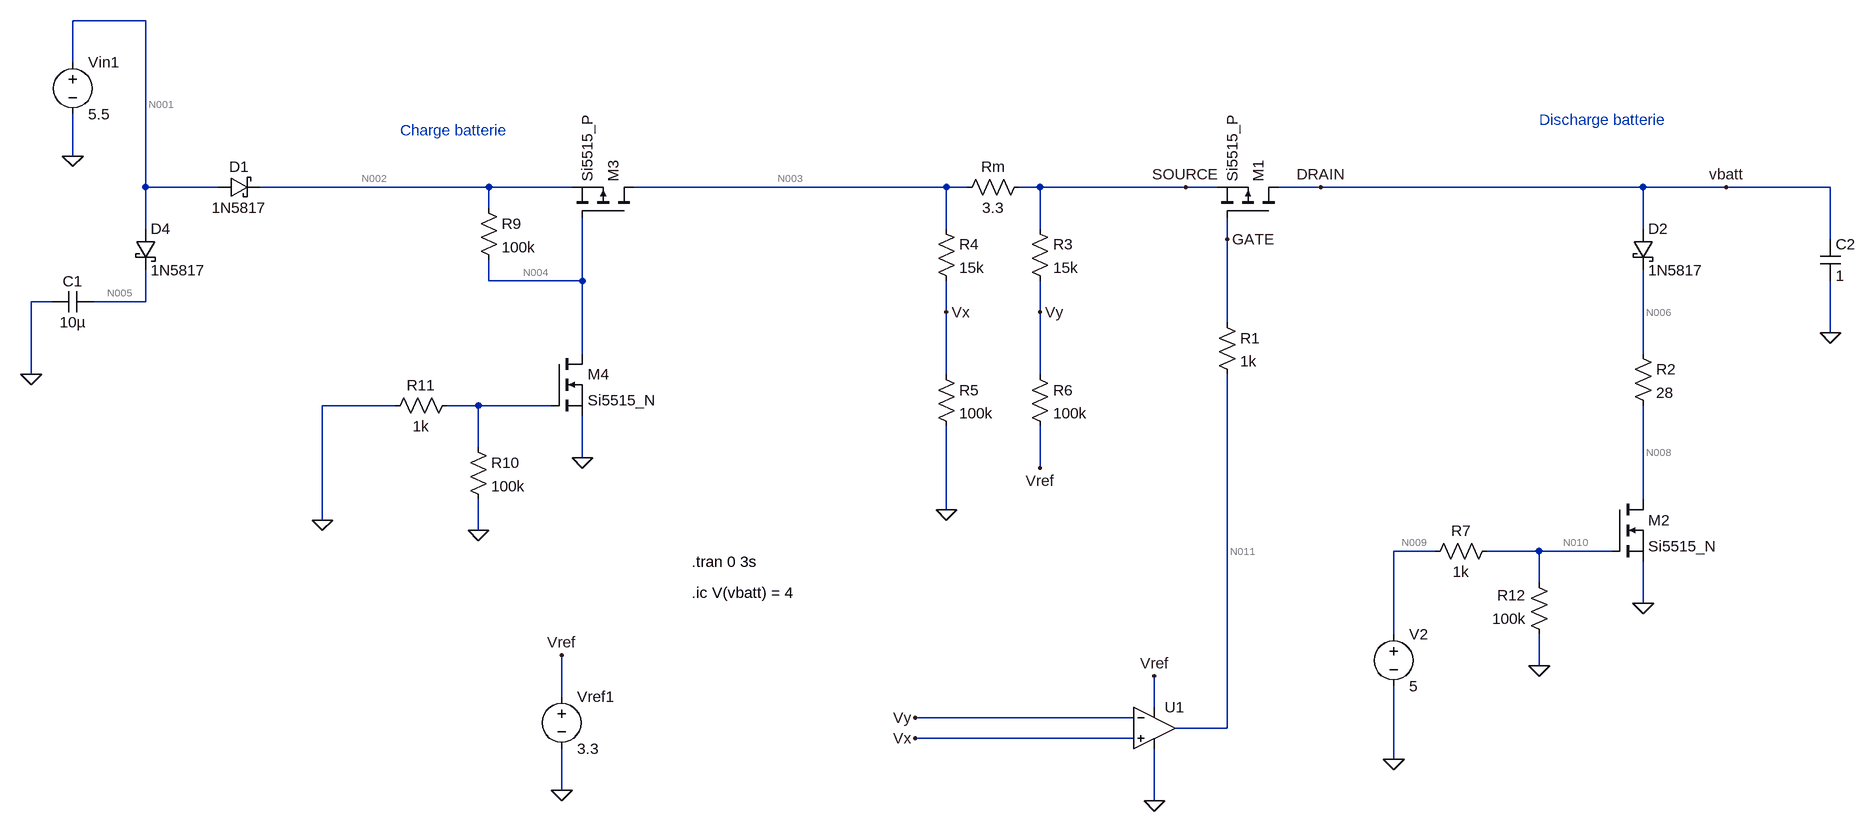
[diagram p0: schematic current_source.asc]
current_source.asc, the LTspice schematic file:
Version 4.1
SHEET 1 2588 1328
WIRE -736 -176 -848 -176
WIRE -848 -112 -848 -176
WIRE -848 32 -848 -32
WIRE -736 80 -736 -176
WIRE -624 80 -736 80
WIRE -208 80 -560 80
WIRE -80 80 -208 80
WIRE 496 80 16 80
WIRE 528 80 496 80
WIRE 640 80 608 80
WIRE 864 80 640 80
WIRE 912 80 864 80
WIRE 1072 80 1008 80
WIRE 1568 80 1072 80
WIRE 1696 80 1568 80
WIRE 1856 80 1696 80
WIRE -208 112 -208 80
WIRE -736 144 -736 80
WIRE 496 144 496 80
WIRE 640 144 640 80
WIRE 1568 144 1568 80
WIRE 928 160 928 128
WIRE 1856 160 1856 80
WIRE -208 224 -208 192
WIRE -64 224 -64 128
WIRE -64 224 -208 224
WIRE -880 256 -912 256
WIRE -736 256 -736 208
WIRE -736 256 -816 256
WIRE 496 272 496 224
WIRE 640 272 640 224
WIRE 928 288 928 160
WIRE 1856 304 1856 224
WIRE -64 336 -64 224
WIRE 1568 336 1568 208
WIRE -912 368 -912 256
WIRE 496 368 496 272
WIRE 640 368 640 272
WIRE -352 416 -464 416
WIRE -224 416 -272 416
WIRE -112 416 -224 416
WIRE -224 480 -224 416
WIRE -64 496 -64 432
WIRE 640 512 640 448
WIRE 1568 560 1568 416
WIRE 496 576 496 448
WIRE -464 592 -464 416
WIRE -224 608 -224 560
WIRE 1248 640 1184 640
WIRE 1408 640 1328 640
WIRE 1520 640 1408 640
WIRE 1408 688 1408 640
WIRE 1568 720 1568 656
WIRE 1184 768 1184 640
WIRE 1408 816 1408 768
WIRE -96 864 -96 800
WIRE 816 880 816 832
WIRE 784 896 448 896
WIRE 928 912 928 368
WIRE 928 912 848 912
WIRE 784 928 448 928
WIRE 1184 960 1184 848
WIRE -96 1008 -96 944
WIRE 816 1024 816 944
FLAG 1856 304 0
FLAG 1568 720 0
FLAG 1184 960 0
FLAG 496 272 Vx
FLAG 640 272 Vy
FLAG 448 928 Vx
FLAG 448 896 Vy
FLAG 496 576 0
FLAG 928 160 GATE
FLAG 864 80 SOURCE
FLAG 1072 80 DRAIN
FLAG 816 832 Vref
FLAG 816 1024 0
FLAG -848 32 0
FLAG -912 368 0
FLAG -64 496 0
FLAG -224 608 0
FLAG 1408 816 0
FLAG -464 592 0
FLAG 1696 80 vbatt
FLAG -96 1008 0
FLAG -96 800 Vref
FLAG 640 512 Vref
SYMBOL res 512 96 R270
WINDOW 0 32 56 VTop 2
WINDOW 3 0 56 VBottom 2
SYMATTR InstName Rm
SYMATTR Value 3.3
SYMBOL pmos 1008 128 M270
SYMATTR InstName M1
SYMATTR Value Si5515_P
SYMBOL nmos 1520 560 R0
SYMATTR InstName M2
SYMATTR Value Si5515_N
SYMBOL res 912 272 R0
SYMATTR InstName R1
SYMATTR Value 1k
SYMBOL res 1552 320 R0
SYMATTR InstName R2
SYMATTR Value 28
SYMBOL schottky -624 96 R270
WINDOW 0 32 32 VTop 2
WINDOW 3 0 32 VBottom 2
SYMATTR InstName D1
SYMATTR Value 1N5817
SYMBOL OpAmps\\UniversalOpAmp2 816 912 R0
SYMATTR InstName U1
SYMBOL res 624 128 R0
SYMATTR InstName R3
SYMATTR Value 15k
SYMBOL res 480 128 R0
SYMATTR InstName R4
SYMATTR Value 15k
SYMBOL res 480 352 R0
SYMATTR InstName R5
SYMATTR Value 100k
SYMBOL res 624 352 R0
SYMATTR InstName R6
SYMATTR Value 100k
SYMBOL schottky 1552 144 R0
SYMATTR InstName D2
SYMATTR Value 1N5817
SYMBOL res 1344 624 R90
WINDOW 0 0 56 VBottom 2
WINDOW 3 32 56 VTop 2
SYMATTR InstName R7
SYMATTR Value 1k
SYMBOL schottky -752 144 R0
SYMATTR InstName D4
SYMATTR Value 1N5817
SYMBOL voltage -848 -128 R0
SYMATTR InstName Vin1
SYMATTR Value 5.5
SYMBOL cap -816 240 R90
WINDOW 0 0 32 VBottom 2
WINDOW 3 32 32 VTop 2
SYMATTR InstName C1
SYMATTR Value 10µ
SYMBOL pmos 16 128 M270
SYMATTR InstName M3
SYMATTR Value Si5515_P
SYMBOL nmos -112 336 R0
SYMATTR InstName M4
SYMATTR Value Si5515_N
SYMBOL res -224 96 R0
SYMATTR InstName R9
SYMATTR Value 100k
SYMBOL res -240 464 R0
SYMATTR InstName R10
SYMATTR Value 100k
SYMBOL res -256 400 R90
WINDOW 0 0 56 VBottom 2
WINDOW 3 32 56 VTop 2
SYMATTR InstName R11
SYMATTR Value 1k
SYMBOL res 1424 784 R180
WINDOW 0 36 76 Left 2
WINDOW 3 36 40 Left 2
SYMATTR InstName R12
SYMATTR Value 100k
SYMBOL voltage 1184 752 R0
WINDOW 123 0 0 Left 0
WINDOW 39 0 0 Left 0
SYMATTR InstName V2
SYMATTR Value 5
SYMBOL voltage -96 848 R0
SYMATTR InstName Vref1
SYMATTR Value 3.3
SYMBOL cap 1840 160 R0
SYMATTR InstName C2
SYMATTR Value 1
TEXT -344 -8 Left 2 ;Charge batterie
TEXT 1408 -24 Left 2 ;Discharge batterie
TEXT 104 656 Left 2 !.tran 0 3s
TEXT 104 704 Left 2 !.ic V(vbatt) = 4

The netlist it stands for:
* current_source.asc
Rm N003 SOURCE 3.3
M1 vbatt GATE SOURCE SOURCE Si5515_P
M2 N008 N010 0 0 Si5515_N
R1 GATE N011 1k
R2 N006 N008 28
D1 N001 N002 1N5817
X§U1 Vx Vy Vref 0 N011 level2 Avol=1Meg GBW=10Meg Slew=10Meg Ilimit=25m Rail=0 Vos=0 En=0 Enk=0 In=0 Ink=0 Rin=500Meg  ; pins In+ In- V+ V- OUT
R3 SOURCE Vy 15k
R4 N003 Vx 15k
R5 Vx 0 100k
R6 Vy Vref 100k
D2 vbatt N006 1N5817
R7 N010 N009 1k
D4 N001 N005 1N5817
Vin1 N001 0 5.5
C1 N005 0 10µ
M3 N003 N004 N002 N002 Si5515_P
M4 N004 N007 0 0 Si5515_N
R9 N002 N004 100k
R10 N007 0 100k
R11 N007 0 1k
R12 0 N010 100k
V2 N009 0 5
Vref1 Vref 0 3.3
C2 vbatt 0 1
.model D D
.lib standard.dio
.model NMOS NMOS
.model PMOS PMOS
.lib standard.mos
* Charge batterie
* Discharge batterie
.tran 0 3s
.ic V(vbatt) = 4
.lib UniversalOpAmp2.lib
.backanno
.end

* Results of the author's LTspice run, read from the files saved beside the schematic
* Operating Point, zero values left out:
*   V(gate) = 3.541 µV
*   V(n001) = 5.5 V
*   V(n002) = 5.5 V
*   V(n003) = 4 V
*   V(n004) = 5.488 V
*   V(n005) = 5.5 V
*   V(n006) = 3.697 V
*   V(n008) = 4.049 mV
*   V(n009) = 5 V
*   V(n010) = 4.95 V
*   V(n011) = 3.541 µV
*   V(source) = 4 V
*   V(vbatt) = 4 V
*   V(vref) = 3.3 V
*   V(vx) = 3.478 V
*   V(vy) = 3.909 V
*   I(C2) = 4 pA
*   I(D1) = 116.6 nA
*   I(D2) = 131.9 mA
*   I(R12) = -49.5 µA
*   I(R2) = 131.9 mA
*   I(R3) = 6.091 µA
*   I(R4) = 34.78 µA
*   I(R5) = 34.78 µA
*   I(R6) = 6.086 µA
*   I(R7) = -49.5 µA
*   I(R9) = 116.5 nA
*   I(Rm) = -34.78 µA
*   I(V2) = -49.5 µA
*   I(Vin1) = -116.6 nA
*   I(Vref1) = 5.666 µA
*   Id(M1) = 40.88 µA
*   Id(M2) = 131.9 mA
*   Id(M3) = -118.1 pA
*   Id(M4) = 116.5 nA
*   Is(M1) = -40.88 µA
*   Is(M2) = -131.9 mA
*   Is(M3) = 118.1 pA
*   Is(M4) = -116.5 nA
*   Ix(u1:1) = 3.656 nA
*   Ix(u1:2) = 4.517 nA
*   Ix(u1:3) = 419.9 nA
*   Ix(u1:4) = -286.8 nA
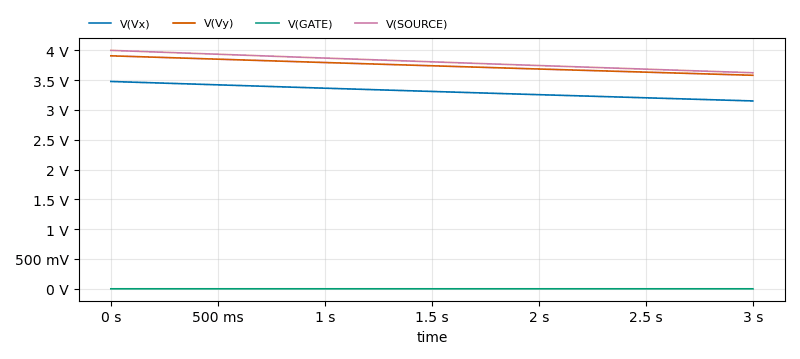
[diagram p1: Transient Analysis of current_source.asc, plotted from the saved traces]
* Transient Analysis, 1 run:
*   V(Vx): min 3.152 V, max 3.478 V, average 3.312 V, rms 3.313 V, last 3.152 V
*   V(Vy): min 3.582 V, max 3.909 V, average 3.742 V, rms 3.744 V, last 3.582 V
*   V(GATE): min 3.42 µV, max 3.541 µV, average 3.427 µV, rms 3.427 µV, last 3.433 µV
*   V(SOURCE): min 3.624 V, max 4 V, average 3.809 V, rms 3.81 V, last 3.624 V